# Altium project ABZ_DEBUG.PrjPcb
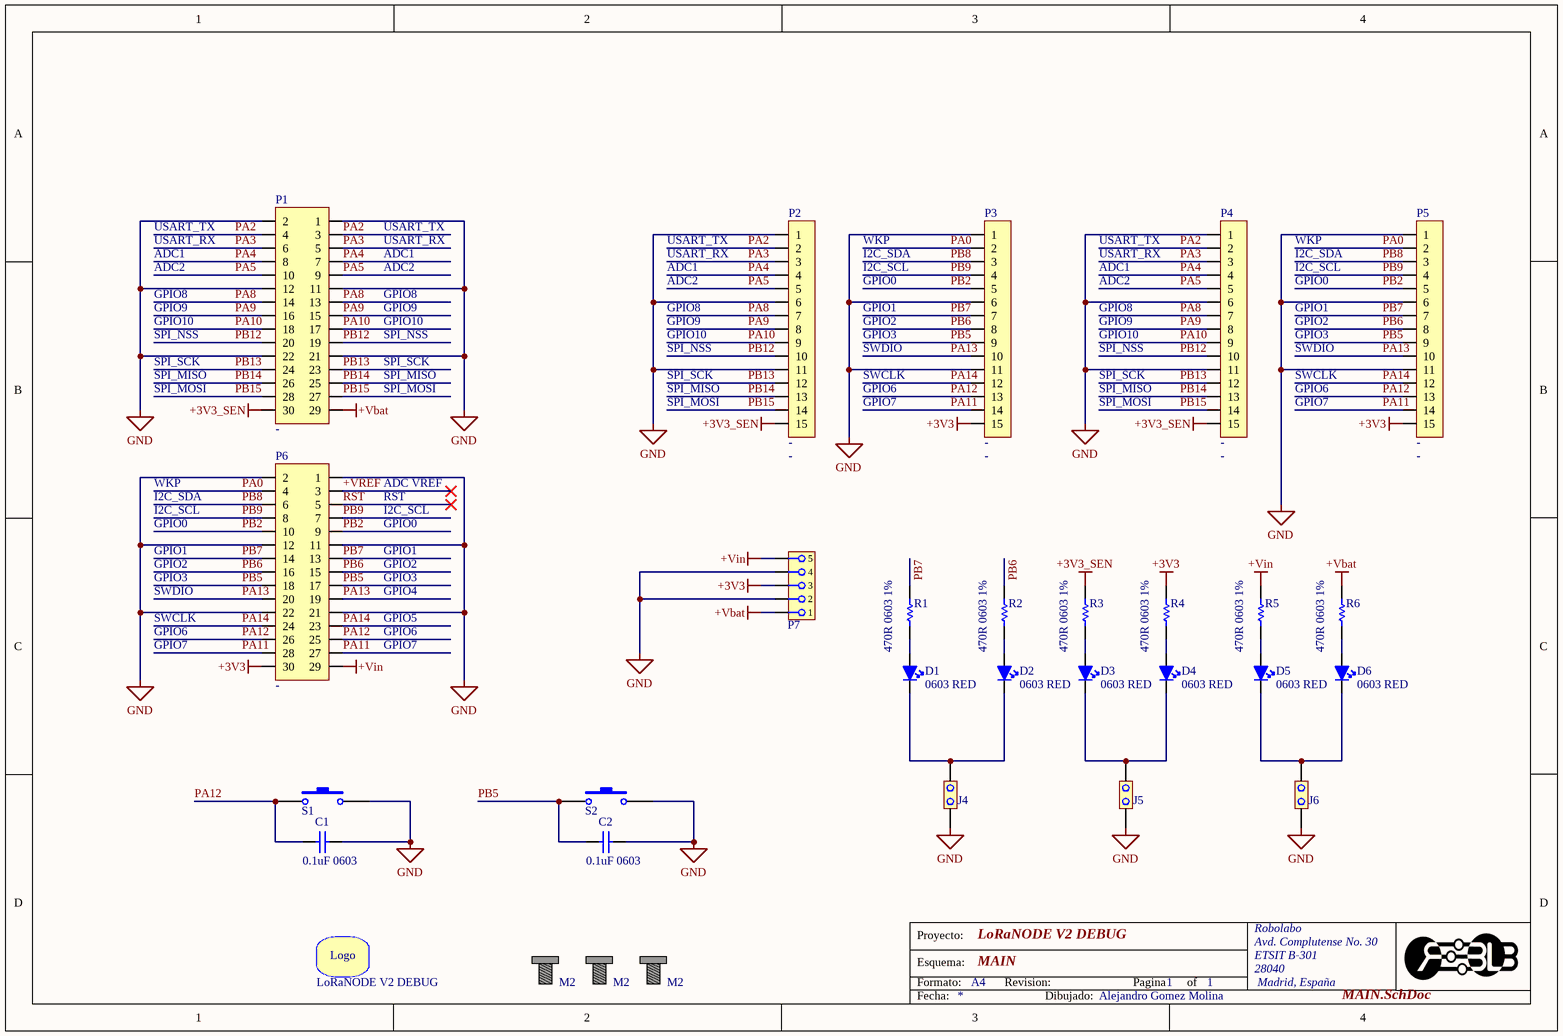
[diagram p0: MAIN.SchDoc]
1 sheet, 30 parts. Net scope: global (net labels, ports and power ports of the same name join across sheets).
Board file: DEBUG_ABZ.PcbDoc

## Sheet MAIN.SchDoc: LoRaNODE V2 DEBUG
size A4; DrawnBy: Alejandro Gomez Molina; Organization: Robolabo; Address1: Avd. Complutense No. 30; Address2: ETSIT B-301; Address3: 28040; Address4: Madrid, España; SheetNumber: 1; SheetTotal: 1; PageSize: A4; SheetName: MAIN

### Parts
C1  0.1uF 0603  [CAP_SMD_0603]
C2  0.1uF 0603  [CAP_SMD_0603]
D1  0603 RED  [DIODE_LED_SMD_0603]
D2  0603 RED  [DIODE_LED_SMD_0603]
D3  0603 RED  [DIODE_LED_SMD_0603]
D4  0603 RED  [DIODE_LED_SMD_0603]
D5  0603 RED  [DIODE_LED_SMD_0603]
D6  0603 RED  [DIODE_LED_SMD_0603]
J4  -  [JUMPER_1x2_2.54]  (value not drawn)
J5  -  [JUMPER_1x2_2.54]  (value not drawn)
J6  -  [JUMPER_1x2_2.54]  (value not drawn)
logo1  LoRaNODE V2 DEBUG  [Robolabo10x25]  (no BOM)
P1  -  [CONN-2X15-1.27-FEMALE_RECT-SMD]  (no BOM)
P2  -  [CONN-1X15-2.54-MALE-TH]  (no BOM)
P3  -  [CONN-1X15-2.54-MALE-TH]  (no BOM)
P4  -  [CONN-1X15-2.54-MALE-TH-NOPIN]  (no BOM)
P5  -  [CONN-1X15-2.54-MALE-TH-NOPIN]  (no BOM)
P6  -  [CONN-2X15-1.27-FEMALE_RECT-SMD]  (no BOM)
P7  -  [CONN-1X5-2.54-MALE-TH]  (value not drawn)
R1  470R 0603 1%  [RES_SMD_0603]
R2  470R 0603 1%  [RES_SMD_0603]
R3  470R 0603 1%  [RES_SMD_0603]
R4  470R 0603 1%  [RES_SMD_0603]
R5  470R 0603 1%  [RES_SMD_0603]
R6  470R 0603 1%  [RES_SMD_0603]
S1  SPST 4.6x2.8mm  [KMR4_CK_SWITCH]  (value not drawn)
S2  SPST 4.6x2.8mm  [KMR4_CK_SWITCH]  (value not drawn)
screw1  M2  [M2]
screw2  M2  [M2_NOPAD]
screw3  M2  [M2_NOPAD]

### Nets
+3V3: P3.15 P5.15 P6.30 P7.3 R4.2
+3V3_SEN: P1.30 P2.15 P4.15 R3.2
+Vbat: P1.29 P7.1 R6.2
+Vin: P6.29 P7.5 R5.2
GND: C1.2 C2.2 J4.1 J5.1 J6.1 P1.1 P1.2 P1.11 P1.12 P1.21 P1.22 P2.1 P2.6 P2.11 P3.1 P3.6 P3.11 P4.1 P4.6 P4.11 P5.1 P5.6 P5.11 P6.1 P6.2 P6.11 P6.12 P6.21 P6.22 P7.2 P7.4 S1.2 S2.2
+VREF: P6.3
PA0: P3.2 P5.2 P6.4
PA2: P1.3 P1.4 P2.2 P4.2
PA3: P1.5 P1.6 P2.3 P4.3
PA4: P1.7 P1.8 P2.4 P4.4
PA5: P1.9 P1.10 P2.5 P4.5
PA8: P1.13 P1.14 P2.7 P4.7
PA9: P1.15 P1.16 P2.8 P4.8
PA10: P1.17 P1.18 P2.9 P4.9
PA11: P3.14 P5.14 P6.27 P6.28
PA12: C1.1 P3.13 P5.13 P6.25 P6.26 S1.1
PA13: P3.10 P5.10 P6.19 P6.20
PA14: P3.12 P5.12 P6.23 P6.24
PB2: P3.5 P5.5 P6.9 P6.10
PB5: C2.1 P3.9 P5.9 P6.17 P6.18 S2.1
PB6: P3.8 P5.8 P6.15 P6.16 R2.2
PB7: P3.7 P5.7 P6.13 P6.14 R1.2
PB8: P3.3 P5.3 P6.6
PB9: P3.4 P5.4 P6.7 P6.8
PB12: P1.19 P1.20 P2.10 P4.10
PB13: P1.23 P1.24 P2.12 P4.12
PB14: P1.25 P1.26 P2.13 P4.13
PB15: P1.27 P1.28 P2.14 P4.14
RST: P6.5
NetD1_1: D1.1(A) R1.1
NetD1_2: D1.2(K) D2.2(K) J4.2
NetD2_1: D2.1(A) R2.1
NetD3_1: D3.1(A) R3.1
NetD3_2: D3.2(K) D4.2(K) J5.2
NetD4_1: D4.1(A) R4.1
NetD5_1: D5.1(A) R5.1
NetD5_2: D5.2(K) D6.2(K) J6.2
NetD6_1: D6.1(A) R6.1

### Notes on the sheet
- USART_TX
- USART_RX
- WKP
- ADC1
- ADC2
- GPIO8
- GPIO9
- I2C_SCL
- I2C_SDA
- GPIO0
- GPIO1
- GPIO10
- SPI_NSS
- SPI_SCK
- SPI_MISO
- GPIO2
- GPIO3
- SWDIO
- SWCLK
- SPI_MOSI
- GPIO6
- GPIO7
- ADC VREF
- RST
- GPIO4
- GPIO5
- Proyecto:
- Formato:
- Esquema:
- Revision:
- Pagina
- of
- Fecha:
- Dibujado:
- (in symbol Robolabo) Logo

### Library data of the parts
C1 C2 = C0603C104K9RACTU: Cap Ceramic 0.1uF 6.3V X7R 10% Pad SMD 0603 125°C T/R; Manufacturer 1: KEMET; Capacitance: 100nF; Dissipation Factor: 5%; Supplier 1: Mouser; Manufacturer Part Number 1: C0603C104K9RACTU; RoHS: Yes; Category: Ceramic Capacitors; Stock 1: 22809; Pricing 1: 1=0,19000, 10=0,13800, 100=0,04500, 1000=0,03700, 4000=0,02700, 8000=0,02400 (USD); Mount: Surface Mount; Case/Package: 0603; Case Code (Imperial): 0603; Case Code (Metric): 1608; Dielectric Material: Ceramic; Min Operating Temperature: -55°C; Max Operating Temperature: 125°C; Package Quantity: 4000; Voltage Rating: 6.3V; Tolerance: 10%; Packaging: Tape and Reel; Voltage Rating (DC): 6.3V; Dielectric: X7R; Termination: SMD/SMT; Length: 1.6mm; Height: 0.8mm; Width: 0.8mm; Depth: 0.8mm; Thickness: 0.034inch; Radiation Hardening: No; ComponentLink1URL: https://datasheet.ciiva.com/13371/kem-c1002-x7r-smd-357932-13371879.pdf?src-supplier=Mouser; ComponentLink1Description: https://datasheet.ciiva.com/13371/kem-c1002-x7r-smd-357932-13371879.pdf?src-supplier=Mouser; Supplier Part Number 1: 80-C0603C104K9R
D1-D6 = KPG1-1608SURC-TT: Led, Red, 65MCD, 631NM, SMD, 1608; Manufacturer: Kingbright; Supplier 1: RSComponents; RoHS: No; Stock 1: 2675; Pricing 1: 25=0.16500 (USD); ComponentLink1URL: http://www.farnell.com/datasheets/2163487.pdf?src-supplier=Farnell; ComponentLink1Description: http://www.farnell.com/datasheets/2163487.pdf?src-supplier=Farnell; Supplier Part Number 1: 1254508; Manufacturer Part Number: KPG1-1608SURC-TT
J4-J6 = JUMPER-1x2-2.54
logo1 = Robolabo
P1 P6 = CONN-2X15-1.27-FEMALE-RECT: CONN-2X15-1.27-MALE-RECT
P2-P5 = CONN-1X15-MALE- RECTO-2.54MM: CONN PIN HEADER 15 2.54MM; Serigrafia: -
P7 = CONN-1X5-2.54-MALE-TH
R1-R6 = CRCW0603470RFKEAHP: RES SMD 470 OHM 1% 1/10W 0603; Manufacturer: Vishay; Temperature Coefficient: 100ppm/°C; Voltage Rating: 75V; Power Rating: 250mW; Supplier 1: Digi-Key; Stock 1: 42034; Pricing 1: 1=0.16000, 10=0.13600, 100=0.05330, 1000=0.02232, 2500=0.02046 (USD); RoHS: Yes; Case/Package: 0603; Resistance: 470R; Tolerance: 1%; Lead Free: Lead Free; Supplier Part Number 1: 541-470SCT-ND; Manufacturer Part Number: CRCW0603470RFKEAHP; Category: Chip SMD Resistors; Mount: Surface Mount; Contact Plating: Tin; Case Code (Metric): 1608; Case Code (Imperial): 0603; Min Operating Temperature: -55°C; Max Operating Temperature: 155°C; Composition: Thick Film; Number of Terminations: 2; Termination: SMD/SMT; Military Standard: Not; Package Quantity: 1; Packaging: Tape and Reel; Features: Automotive AEC-Q200; Voltage Rating (DC): 75V; Max Power Dissipation: 250mW; Length: 1.6mm; Height: 0.022inch; Depth: 0.85mm; Width: 0.033inch; Radiation Hardening: No; REACH SVHC: Unknown; ComponentLink1URL: https://datasheet.ciiva.com/8934/crcwhpe3-8934713.pdf?src-supplier=Avnet; ComponentLink1Description: https://datasheet.ciiva.com/8934/crcwhpe3-8934713.pdf?src-supplier=Avnet; ComponentLink2URL: https://datasheet.ciiva.com/16884/crcwhpe3-16884505.pdf?src-supplier=Avnet+Europe; ComponentLink2Description: https://datasheet.ciiva.com/16884/crcwhpe3-16884505.pdf?src-supplier=Avnet+Europe; ComponentLink3URL: https://datasheet.ciiva.com/7777/424479-7777323.pdf?src-supplier=Element14; ComponentLink3Description: https://datasheet.ciiva.com/7777/424479-7777323.pdf?src-supplier=Element14; ComponentLink4URL: https://datasheet.ciiva.com/7777/424479-7777324.pdf?src-supplier=Element14; ComponentLink4Description: https://datasheet.ciiva.com/7777/424479-7777324.pdf?src-supplier=Element14
S1 S2 = KMR441NGLFS: Manufacturer: ITT C&K; Mechanical Life: 100000Cycles; Voltage Rating (DC): 32V; Current Rating: 50mA; Power Rating: 1W; Operating Force: 4N; Switch Function: Off-Mom; Switch Travel: 0.35mm; Actuator Type: Standard; Illumination Type: Non-Illuminated,Illuminated; Actuator Length: 1.1mm; Supplier 1: Mouser; Supplier Part Number 1: 611-KMR441NGLFS; Manufacturer Part Number: KMR441NGLFS; RoHS: Yes; Category: Tactile Switches; Stock 1: 6000; Pricing 1: 1=0.99000, 10=0.95100, 25=0.93300, 50=0.89700, 100=0.77400, 250=0.70600 (USD); Mount: Surface Mount; Case/Package: SMD/SMT; Contact Material: Silver; Contact Plating: Silver; Min Operating Temperature: -40°C; Max Operating Temperature: 85°C; Orientation: Straight; Packaging: Tape and Reel; Package Quantity: 6000; Termination: Gull Wing; Max Voltage Rating (DC): 32V; Throw Configuration: SPST; Max Current Rating: 50mA; Length: 2.8mm; Depth: 4.6mm; Radiation Hardening: No; REACH SVHC: No SVHC; ComponentLink1URL: https://datasheet.ciiva.com/2900/kmr4-9aug12-2900281.pdf?src-supplier=Digi-Key; ComponentLink1Description: https://datasheet.ciiva.com/2900/kmr4-9aug12-2900281.pdf?src-supplier=Digi-Key; ComponentLink2URL: https://datasheet.ciiva.com/7986/1443639-7986953.pdf?src-supplier=Element14; ComponentLink2Description: https://datasheet.ciiva.com/7986/1443639-7986953.pdf?src-supplier=Element14; ComponentLink3URL: https://datasheet.ciiva.com/2900/kmr4-9aug12-2900282.pdf?src-supplier=Digi-Key; ComponentLink3Description: https://datasheet.ciiva.com/2900/kmr4-9aug12-2900282.pdf?src-supplier=Digi-Key; ComponentLink4URL: https://datasheet.ciiva.com/2900/kmr4-9aug12-2900283.pdf?src-supplier=Digi-Key; ComponentLink4Description: https://datasheet.ciiva.com/2900/kmr4-9aug12-2900283.pdf?src-supplier=Digi-Key; ComponentLink5URL: https://datasheet.ciiva.com/16696/kmr4-9aug12-16696492.pdf?src-supplier=Avnet+Europe; ComponentLink5Description: https://datasheet.ciiva.com/16696/kmr4-9aug12-16696492.pdf?src-supplier=Avnet+Europe
screw1-screw3 = screw_M2